# EAGLE schematic wash_machine (EAGLE 9.6.2)
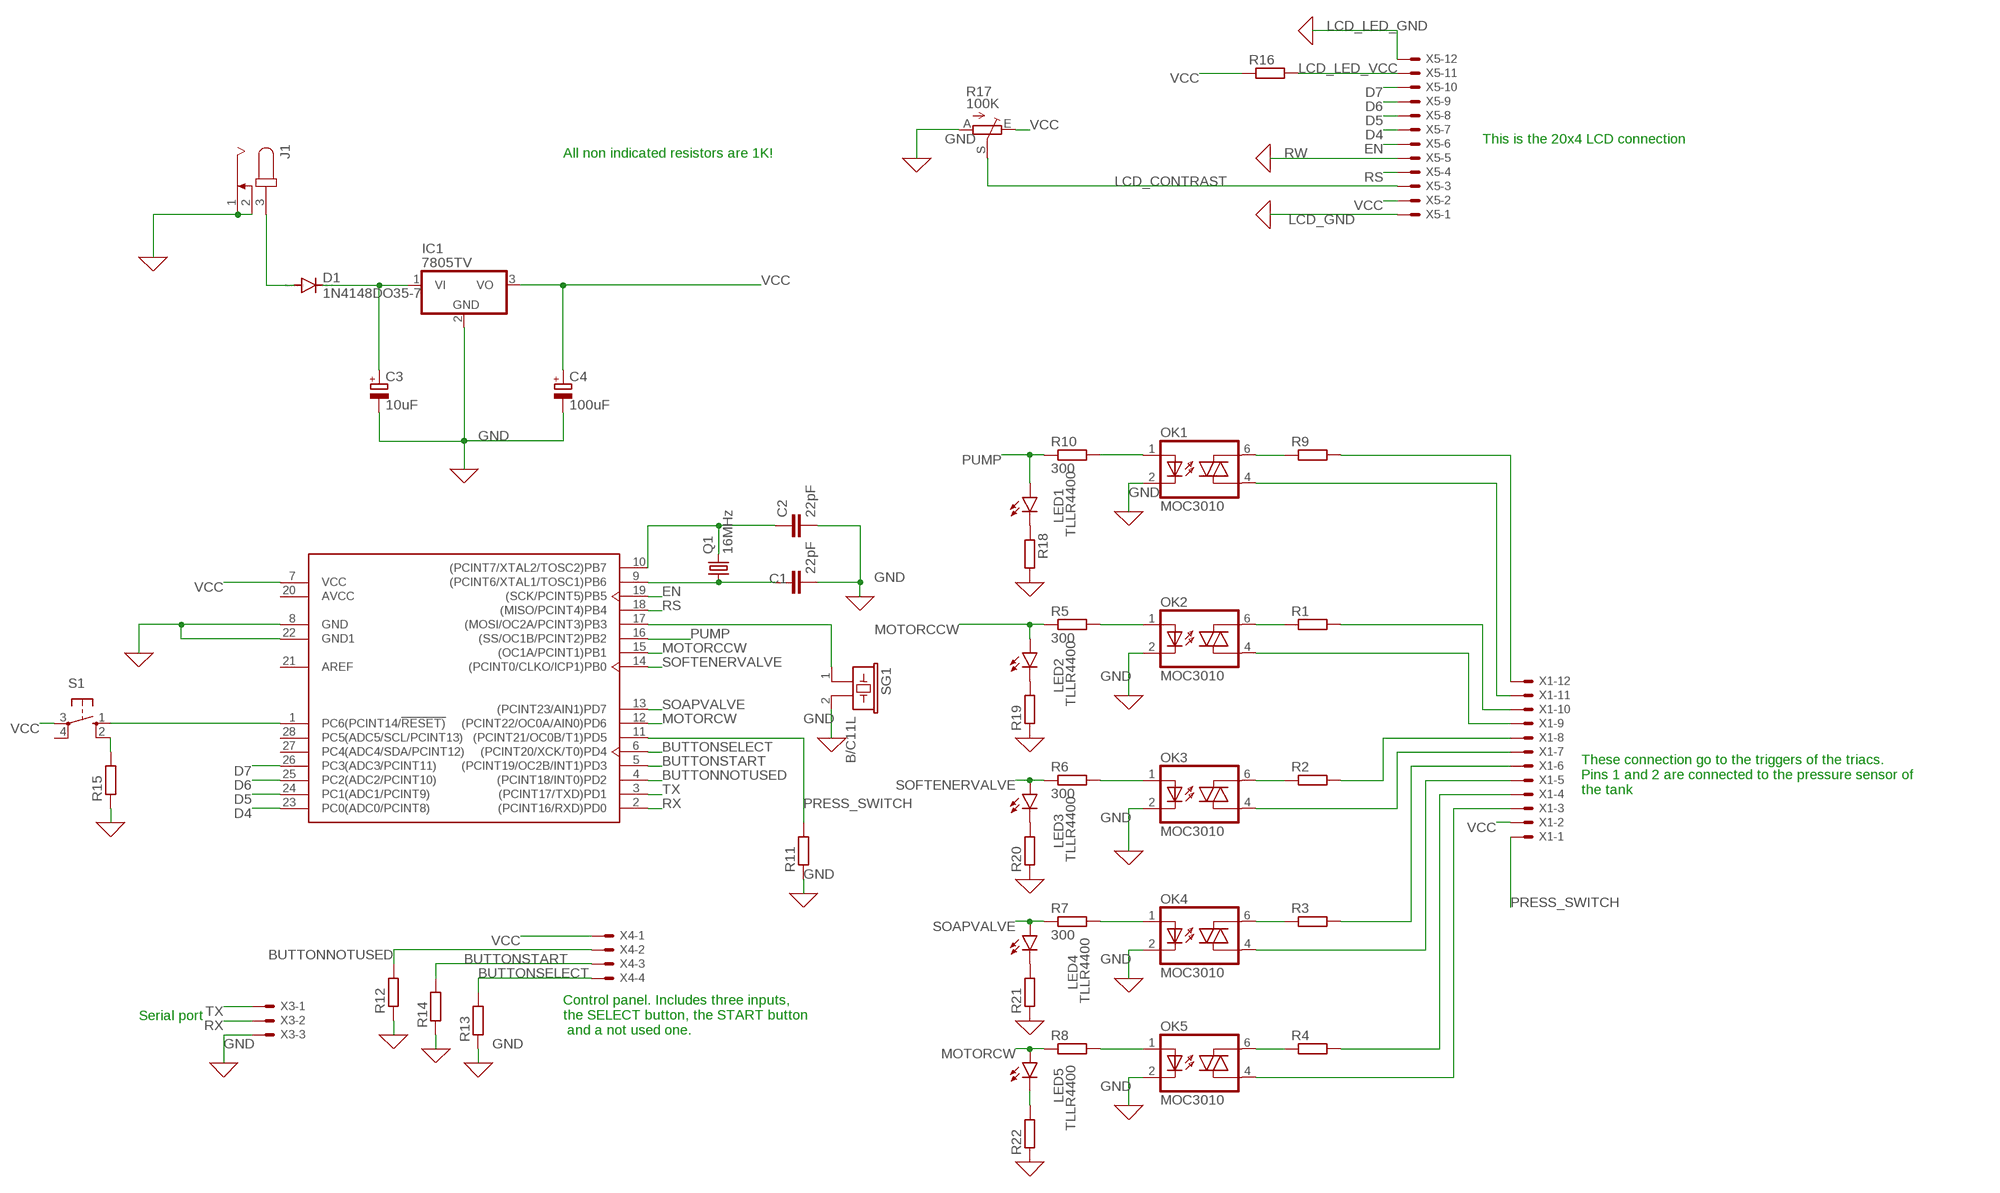
[diagram p0: schematic, sheet 1]

## Parts
C1  22pF  C2,5-3  [C2.5-3]
C2  22pF  C2,5-3  [C2.5-3]
C3  10uF  CPOL-EUB45181A  [B45181A]
C4  100uF  CPOL-EUB45181A  [B45181A]
D1  1N4148DO35-7  [DO35-7]
IC1  7805TV  [TO220V]
J1  JACK-PLUG0  [SPC4077]
LED1  TLLR4400  [LED3MM]
LED2  TLLR4400  [LED3MM]
LED3  TLLR4400  [LED3MM]
LED4  TLLR4400  [LED3MM]
LED5  TLLR4400  [LED3MM]
OK1  MOC3010  [DIL06]
OK2  MOC3010  [DIL06]
OK3  MOC3010  [DIL06]
OK4  MOC3010  [DIL06]
OK5  MOC3010  [DIL06]
Q1  16MHz  CRYSTALHC49U-V  [HC49U-V]
R1  R-EU_0204/7  [0204/7]
R2  R-EU_0204/7  [0204/7]
R3  R-EU_0204/7  [0204/7]
R4  R-EU_0204/7  [0204/7]
R5  300  R-EU_0204/7  [0204/7]
R6  300  R-EU_0204/7  [0204/7]
R7  300  R-EU_0204/7  [0204/7]
R8  R-EU_0204/7  [0204/7]
R9  R-EU_0204/7  [0204/7]
R10  300  R-EU_0204/7  [0204/7]
R11  R-EU_0204/7  [0204/7]
R12  R-EU_0204/7  [0204/7]
R13  R-EU_0204/7  [0204/7]
R14  R-EU_0204/7  [0204/7]
R15  R-EU_0204/7  [0204/7]
R16  R-EU_0204/7  [0204/7]
R17  100K  TRIM_EU-B25U  [B25U]
R18  R-EU_0204/7  [0204/7]
R19  R-EU_0204/7  [0204/7]
R20  R-EU_0204/7  [0204/7]
R21  R-EU_0204/7  [0204/7]
R22  R-EU_0204/7  [0204/7]
S1  10-XX  [B3F-10XX]
SG1  B/C11L  [B/C11L]
U1  ATMEGA328P-PU  [DIP-28]
X1  KK-156-12  [KK-156-12]
X3  KK-156-3  [KK-156-3]
X4  KK-156-4  [KK-156-4]
X5  KK-156-12  [KK-156-12]

## Nets
BUTTONNOTUSED: R12.2 U1.4((PCINT18/INT0)PD2) X4.2
BUTTONSELECT: R13.2 U1.6((PCINT20/XCK/T0)PD4) X4.4
BUTTONSTART: R14.2 U1.5((PCINT19/OC2B/INT1)PD3) X4.3
D4: U1.23(PC0(ADC0/PCINT8)) X5.7
D5: U1.24(PC1(ADC1/PCINT9)) X5.8
D6: U1.25(PC2(ADC2/PCINT10)) X5.9
D7: U1.26(PC3(ADC3/PCINT11)) X5.10
EN: U1.19((SCK/PCINT5)PB5) X5.6
GND: C1.2 C2.2 C3.- C4.- IC1.2(GND) J1.1 J1.2 OK1.2(C) OK2.2(C) OK3.2(C) OK4.2(C) OK5.2(C) R11.1 R12.1 R13.1 R14.1 R15.1 R17.A R18.2 R19.1 R20.1 R21.1 R22.1 SG1.2 U1.8(GND) U1.22(GND1) X3.3
LCD_CONTRAST: R17.S X5.3
LCD_GND: X5.1 ; supply symbol labelled GND
LCD_LED_GND: X5.12 ; supply symbol labelled GND
LCD_LED_VCC: R16.2 X5.11
MOTORCCW: LED2.A R5.1 U1.15((OC1A/PCINT1)PB1)
MOTORCW: LED5.A R8.1 U1.12((PCINT22/OC0A/AIN0)PD6)
N$1: D1.A J1.3
N$2: C3.+ D1.C IC1.1(VI)
N$3: SG1.1 U1.17((MOSI/OC2A/PCINT3)PB3)
N$4: OK5.1(A) R8.2
N$5: C1.1 Q1.1 U1.9((PCINT6/XTAL1/TOSC1)PB6)
N$6: C2.1 Q1.2 U1.10((PCINT7/XTAL2/TOSC2)PB7)
N$7: OK4.1(A) R7.2
N$8: OK3.1(A) R6.2
N$9: OK2.1(A) R5.2
N$10: OK1.6(A2) R9.1
N$11: OK2.6(A2) R1.1
N$12: OK3.6(A2) R2.1
N$13: OK4.6(A2) R3.1
N$14: OK1.1(A) R10.2
N$15: OK5.6(A2) R4.1
N$16: R9.2 X1.12
N$17: OK1.4(A1) X1.11
N$18: R1.2 X1.10
N$19: OK2.4(A1) X1.9
N$20: R2.2 X1.8
N$21: OK3.4(A1) X1.7
N$22: R3.2 X1.6
N$23: OK4.4(A1) X1.5
N$24: R4.2 X1.4
N$25: OK5.4(A1) X1.3
N$26: S1.1(S) U1.1(PC6(PCINT14/!RESET))
N$27: R15.2 S1.2(S1)
N$28: LED1.K(C) R18.1
N$29: LED2.K(C) R19.2
N$30: LED3.K(C) R20.2
N$31: LED4.K(C) R21.2
N$32: LED5.K(C) R22.2
PRESS_SWITCH: R11.2 U1.11((PCINT21/OC0B/T1)PD5) X1.1
PUMP: LED1.A R10.1 U1.16((SS/OC1B/PCINT2)PB2)
RS: U1.18((MISO/PCINT4)PB4) X5.4
RW: X5.5 ; supply symbol labelled GND
RX: U1.2((PCINT16/RXD)PD0) X3.2
SOAPVALVE: LED4.A R7.1 U1.13((PCINT23/AIN1)PD7)
SOFTENERVALVE: LED3.A R6.1 U1.14((PCINT0/CLKO/ICP1)PB0)
TX: U1.3((PCINT17/TXD)PD1) X3.1
VCC: C4.+ IC1.3(VO) R16.1 R17.E S1.3(P) U1.7(VCC) X1.2 X4.1 X5.2
Unconnected: S1.4(P1) U1.21(AREF) U1.27(PC4(ADC4/SDA/PCINT12)) U1.28(PC5(ADC5/SCL/PCINT13))

## Notes on the sheet
- This is the 20x4 LCD connection
- All non indicated resistors are 1K!
- These connection go to the triggers of the triacs.
  Pins 1 and 2 are connected to the pressure sensor of
  the tank
- Serial port
- Control panel. Includes three inputs, 
  the SELECT button, the START button
   and a not used one.

## Power pins joined to a net without a drawn wire
AVCC: U1.20(AVCC)

## Library data of the parts
C1 C2 = capacitor-wima:C: CAPACITOR naming: grid - package width
C3 C4 = rcl:CPOL-EU: POLARIZED CAPACITOR, European symbol; SPICEPREFIX: C
D1 = diode:1N4148: DIODE high speed (Philips)
IC1 = linear:78*: Positive VOLTAGE REGULATOR Source: http://cache.national.com/ds/LM/LM78L05.pdf http://www.fairchildsemi.com/ds/LM/LM7805.pdf
J1 = con-jack:JACK-PLUG: DC POWER JACK Power Jack, DC, Right Angle, Through Hole, Rated 5A at 16VDC, PC Terminals Distributor: Farnell (www.Farnell.de) Drawing: 84N1161.pdf / 84N1162.pdf Manufacturer: SPC Technology (www.spctechnology.com) Type: SPC4077 / SPC 4078; OC_FARNELL: unknown; OC_NEWARK: unknown
LED1-LED5 = led:TLLR4400: Low Current (2mA) LED 3 mm Tinted Diffused Package color RED Source: Data sheet <http://www.farnell.com/datasheets/391100.pdf>; MF: VISHAY SEMICONDUCTOR; OC_FARNELL: 1612437
OK1-OK5 = Johnboiles:MOC3010: Optoisolator Triac Driver Output
Q1 = crystal:CRYSTAL: CRYSTAL; OC_FARNELL: 1666969; OC_NEWARK: unknown
R1-R16 R18-R22 = rcl:R-EU_: RESISTOR, European symbol; SPICEPREFIX: R
R17 = pot:TRIM_EU-: POTENTIOMETER
S1 = switch-omron:10-XX: OMRON SWITCH; MPN: B3F-1000; OC_FARNELL: 176432; OC_NEWARK: 36M3542
SG1 = buzzer:B/C11L: BUZZER Source: Buerklin; OC_FARNELL: unknown; OC_NEWARK: unknown
U1 = Microcontroller:ATMEGA328P-PU: IC MCU 8BIT 32KB FLASH 28DIP Manufacturer's datasheet <http://ww1.microchip.com/downloads/en/DeviceDoc/ATmega48A-PA-88A-PA-168A-PA-328-P-DS-DS40002061A.pdf>; CREATED_BY: PCBLayout.com; DIGIKEY_PART_NUMBER: ATMEGA328P-PU-ND; MANUFACTURER: Microchip Technology; MPN: ATMEGA328P-PU; PACKAGE: DIP-28
X1 X5 = con-molex:KK-156-12: KK 156 HEADER Source: http://www.molex.com/pdm_docs/sd/026604100_sd.pdf; MF: MOLEX; OC_FARNELL: unknown; OC_NEWARK: unknown
X3 = con-molex:KK-156-3: KK 156 HEADER Source: http://www.molex.com/pdm_docs/sd/026604100_sd.pdf; MF: MOLEX; OC_FARNELL: unknown; OC_NEWARK: unknown
X4 = con-molex:KK-156-4: KK 156 HEADER Source: http://www.molex.com/pdm_docs/sd/026604100_sd.pdf; MF: MOLEX; OC_FARNELL: unknown; OC_NEWARK: unknown